# Altium schematic sheet Source_OPV_ADC.SchDoc
size A4; Organization: HTL Hollabrunn; Address1: Abteilung Elektronik; Address2: Anton Ehrenfried-Straße 10; Address3: 2020 Hollabrunn; SheetNumber: 1; SheetTotal: 1; SPICEModelCacheMUVHOLEX: <root> / <DocumentId>MUVHOLEX</DocumentId> / <CacheFrame Number="0"> / <Model Name="ua741" Kind="CKT"> / <Text>*==================================================== / *uA741 / *Sngl GenPurpose OpAmp pkg:DIP8 3,2,7,4,6. pkg:CAN8 3,2,7,4,6. / * Connections: / *             Non-Inverting Input / *             | Inverting Input / *             | | Positive Power Supply / *             | | | Negative Power Supply / *             | | | | Output / *             | | | | | / .SUBCKT UA741 1 2 3 4 5 / C1   11 12 4.664E-12 / C2    6  7 20E-12 / DC    5 53 DX / DE   54  5 DX / DLP  90 91 DX / DLN  92 90 DX / DP    4  3 DX / BGND 99  0 V=V(3)*.5 + V(4)*.5 / BB    7 99 I=I(VB)*10.61E6 - I(VC)*10E6 + I(VE)*10E6 + / +              I(VLP)*10E6 - I(VLN)*10E6 / GA    6  0 11 12 137.7E-6 / GCM   0  6 10 99 2.574E-9 / IEE  10  4 DC 10.16E-6 / HLIM 90  0 VLIM 1K / Q1   11  2 13 QX / Q2   12  1 14 QX / R2    6  9 100E3 / RC1   3 11 7.957E3 / RC2   3 12 7.957E3 / RE1  13 10 2.74E3 / RE2  14 10 2.74E3 / REE  10 99 19.69E6 / RO1   8  5 150 / RO2   7 99 150 / RP    3  4 18.11E3 / VB    9  0 DC 0 / VC    3 53 DC 2.6 / VE   54  4 DC 2.6 / VLIM  7  8 DC 0 / VLP  91  0 DC 25 / VLN   0 92 DC 25 / .MODEL DX D(IS=800E-18) / .MODEL QX NPN(IS=800E-18 BF=62.5) / .ENDS UA741</Text> / </Model> / <Model Name="cap" Kind="MDL"> / <Text>*Default semiconductor capacitor / .MODEL CAP C()</Text> / </Model> / </CacheFrame> / </root>
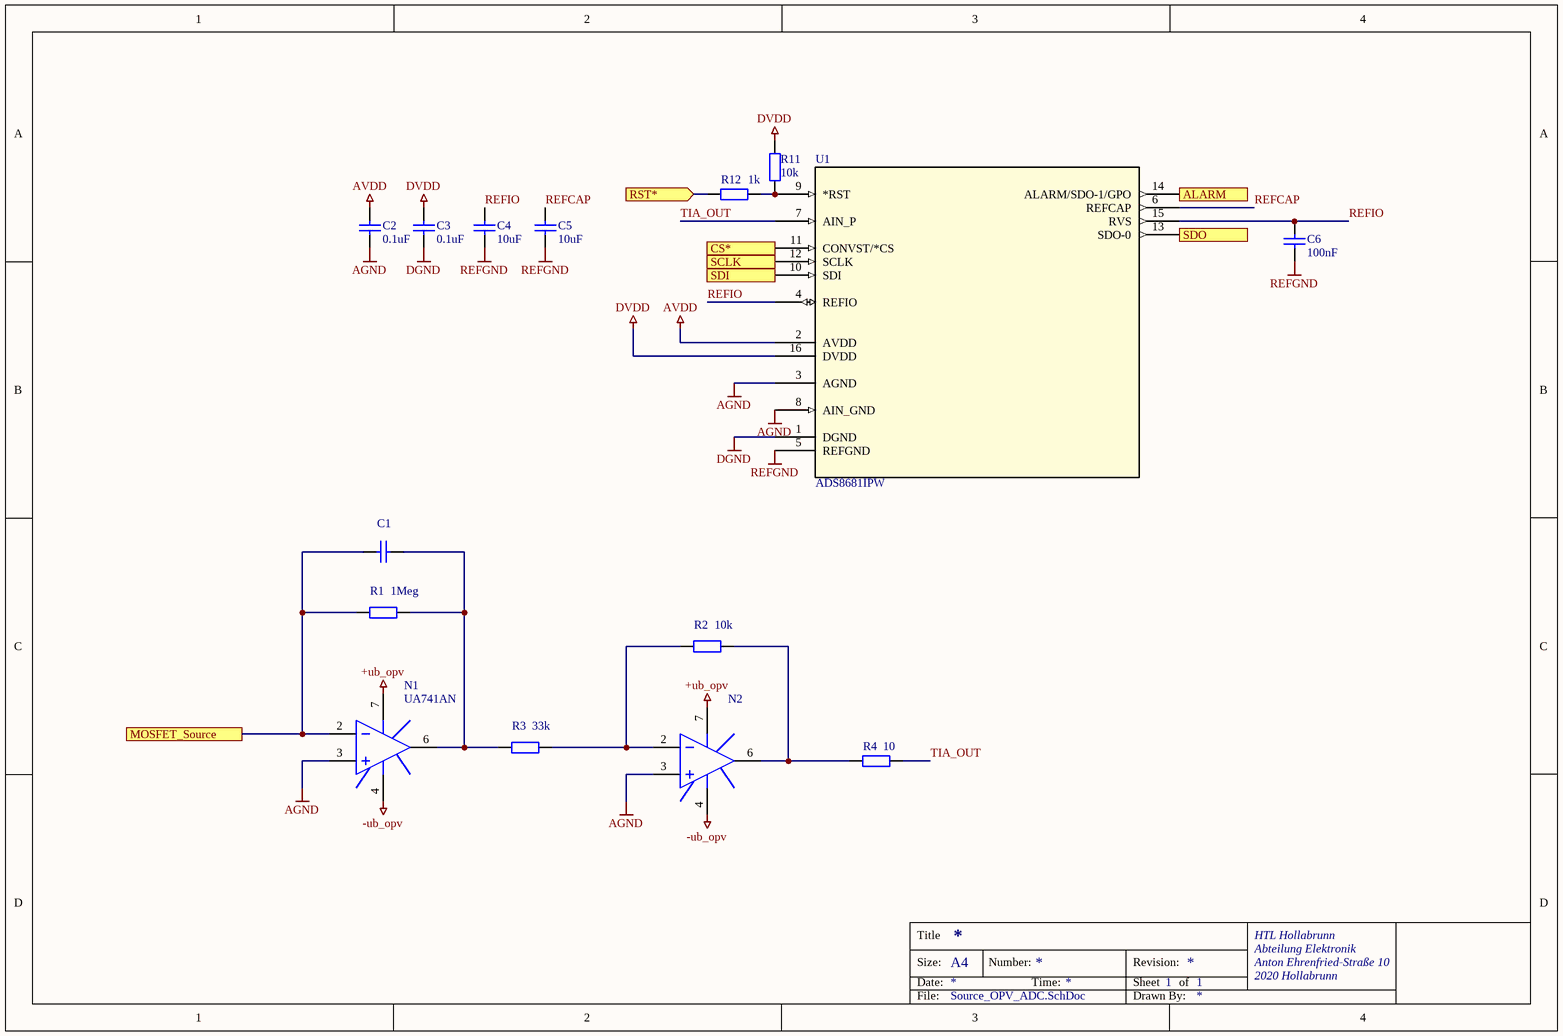
[diagram p0: Source_OPV_ADC.SchDoc]

## Parts
C1  100nF  [C1206-KUE]  (value not drawn)
C2  0.1uF  [C1206-KUE]
C3  0.1uF  [C1206-KUE]
C4  10uF  [C1206-KUE]
C5  10uF  [C1206-KUE]
C6  100nF  [C1206-KUE]
N1  UA741AN  [DIP8]
N2  UA741AN  [DIP8]  (value not drawn)
R1  1Meg  [C1206-KUE]
R2  10k  [C1206-KUE]
R3  33k  [C1206-KUE]
R4  10  [C1206-KUE]
R11  10k  [C1206-KUE]
R12  1k  [C1206-KUE]
U1  ADS8681IPW  [PW16_TEX]

## Ports
ALARM (out), CS* (in), MOSFET_Source, RST* (in), SCLK (in), SDI (in), SDO (out)

## Nets
+ub_opv: N1.7(V+) N2.7(V+)
-ub_opv: N1.4(V-) N2.4(V-)
AGND: C2.1 N1.3(IN+) N2.3(IN+) U1.3(AGND) U1.8(AIN_GND)
AVDD: C2.2 U1.2(AVDD)
DGND: C3.1 U1.1(DGND)
DVDD: C3.2 R11.1 U1.16(DVDD)
REFGND: C4.1 C5.1 C6.1 U1.5(REFGND)
ALARM: U1.14(ALARM/SDO-1/GPO) ; port ALARM
CS*: U1.11(CONVST/*CS) ; port CS*
MOSFET_Source: C1.1 N1.2(IN-) R1.2 ; port MOSFET_Source
REFCAP: C5.2 U1.6(REFCAP)
REFIO: C4.2 C6.2 U1.4(REFIO) U1.15(RVS)
RST*: R12.1 ; port RST*
SCLK: U1.12(SCLK) ; port SCLK
SDI: U1.10(SDI) ; port SDI
SDO: U1.13(SDO-0) ; port SDO
TIA_OUT: R4.1 U1.7(AIN_P)
NetC1_2: C1.2 N1.6(OUT) R1.1 R3.2
NetN2_2: N2.2(IN-) R2.2 R3.1
NetN2_6: N2.6(OUT) R2.1 R4.2
NetR11_2: R11.2 R12.2 U1.9(*RST)

Not connected (* = marked no-connect by the designer): N1 1(OS_NULL) 5(OS_NULL) 8(NC); N2 1(OS_NULL) 5(OS_NULL) 8(NC)

## Notes on the sheet
- Title
- Size:
- Date:
- A4
- Number:
- Time:
- Revision:
- Sheet
- of
- HTL Hollabrunn
- Abteilung Elektronik
- Anton Ehrenfried-Straße 10
- 2020 Hollabrunn
- File:
- Drawn By:

## Library data of the parts
C1-C6 = Capacitor: Manufacturer: Kemet; Bezeichnung: Kerko +-10% 63V; Published: 8-Jun-2000; LatestRevisionDate: 17-Jul-2002; LatestRevisionNote: Re-released for DXP Platform.; PackageReference: RAD-0.3; Publisher: Altium Limited; PackageDescription: Radial Cap, Thru-Hole; 2 Leads; 0.3 in Pin Spacing; Orderingcode: *
  C1 C6: Value: 100nF
  C2 C3: Value: 0.1uF
  C4 C5: Value: 10uF
N1 N2 = UA741AN: General-Purpose Single Operational Amplifier; Published: 24-Aug-2001; LatestRevisionDate: 06-Jun-2005; LatestRevisionNote: Stylized 3D Model Added.; DatasheetVersion: Oct-1997; PackageReference: DIP8; Publisher: Altium Limited; PackageDescription: DIP; 8 Leads; Row Spacing 7.62 mm; Pitch 2.54 mm; Code_JEDEC: MO-001-AN; ComponentLink1Description: Manufacturer Link; ComponentLink1URL: http://www.st.com/; ComponentLink2Description: Datasheet; ComponentLink2URL: http://www.st.com/stonline/products/literature/ds/5304/ua741.pdf
R1-R4 R11 R12 = ResistorSMD: Resistor SMD; Manufacturer: AVX; Bezeichnung: SMD Wid. 1/8W 2%; Published: 8-Jun-2000; LatestRevisionDate: 17-Jul-2002; LatestRevisionNote: Re-released for DXP Platform.; PackageReference: AXIAL-0.4; Publisher: Altium Limited; PackageDescription: Axial Device, Thru-Hole; 2 Leads; 0.4 in Pin Spacing; Orderingcode: *
  R1: Value: 1Meg
  R2 R11: Value: 10k
  R3: Value: 33k
  R4: Value: 10
  R12: Value: 1k
U1 = ADS8681IPW: 16-bit, 1MSPS 1-ch SAR ADC with programmable (Â±12V, Â±10V, Â±6V, Â±5V, Â±2.5V) input ranges on 5V supply 16-TSSOP -40 to 125; Manufacturer_Name: Texas Instruments; Copyright: Copyright (C) 2025 Ultra Librarian. All rights reserved.; Manufacturer_Part_Number: ADS8681IPW; RefDes: RefDes; Type: Type